# Altium schematic sheet peri.SchDoc: Peripherals
size A3; DrawnBy: MAC; Organization: Altium Limited; DocumentNumber: 4; Revision: 0; SheetNumber: 4; SheetTotal: 4; Project: FotoKite; DrwanWhen: Nov.2013; CheckedWhen: When?; ProjectName: ProjectName?
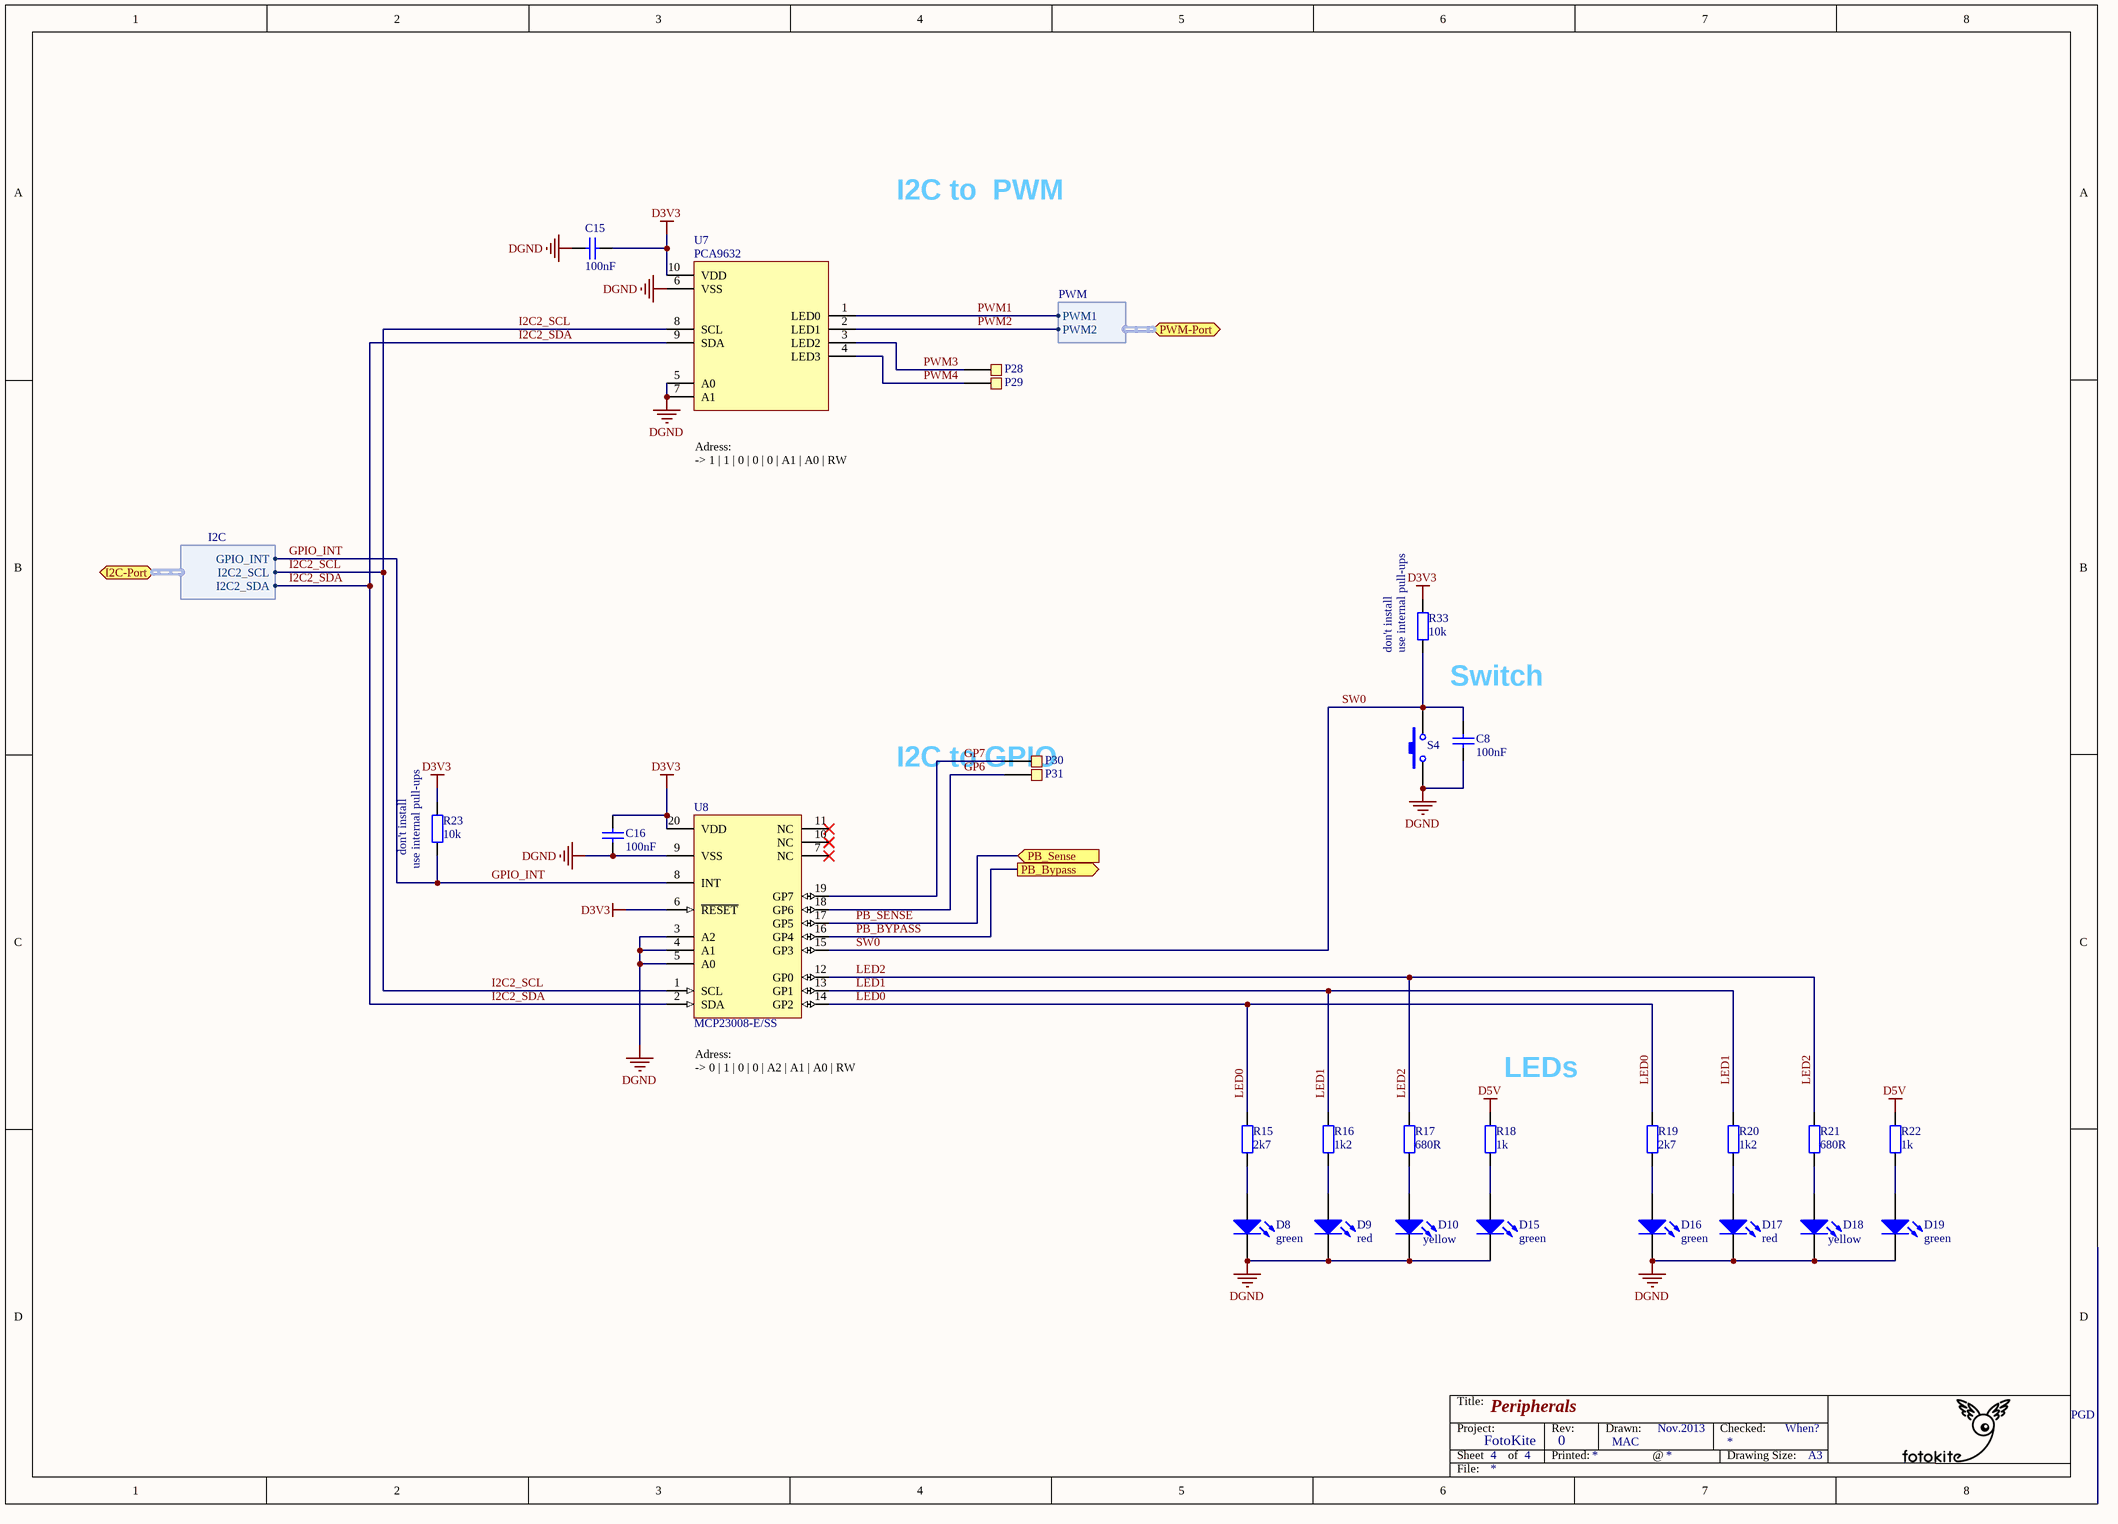
[diagram p0: peri.SchDoc]

## Parts
C8  100nF  [CAP_0603i_1608m -N]
C15  100nF  [CAP_0603i_1608m -N]
C16  100nF  [CAP_0603i_1608m -N]
D8  Colour: green  [LED_LTST_SIDE]  (hidden comment: Diode LED green)
D9  Colour: red  [LED_LTST_SIDE]  (hidden comment: Diode LED red)
D10  Colour: yellow  [LED_LTST_SIDE]  (hidden comment: Diode LED yellow)
D15  Colour: green  [LED_LTST_SIDE]  (hidden comment: Diode LED green)
D16  Colour: green  [LED_LTST_SIDE]  (hidden comment: Diode LED green)
D17  Colour: red  [LED_LTST_SIDE]  (hidden comment: Diode LED red)
D18  Colour: yellow  [LED_LTST_SIDE]  (hidden comment: Diode LED yellow)
D19  Colour: green  [LED_LTST_SIDE]  (hidden comment: Diode LED green)
P28  Pad  [Pad_0603]  (value not drawn)
P29  Pad  [Pad_0603]  (value not drawn)
P30  Pad  [Pad_0603]  (value not drawn)
P31  Pad  [Pad_0603]  (value not drawn)
R15  2k7  [RES_0603i_1608m -N]
R16  1k2  [RES_0603i_1608m -N]
R17  680R  [RES_0603i_1608m -N]
R18  1k  [RES_0603i_1608m -N]
R19  2k7  [RES_0603i_1608m -N]
R20  1k2  [RES_0603i_1608m -N]
R21  680R  [RES_0603i_1608m -N]
R22  1k  [RES_0603i_1608m -N]
R23  10k  Note: don't install  Note2: use internal pull-ups  [RES_0603i_1608m -N]
R33  10k  Note: don't install  Note2: use internal pull-ups  [RES_0603i_1608m -N]
S4  EVQ-PUB02K  [EVQPU]  (value not drawn)
U7  PCA9632  [TSSOP10_L]
U8  MCP23008-E/SS  [SSOP-SS20_N]

## Ports
I2C-Port (harness I2C), PB_Bypass (out), PB_Sense, PWM-Port (harness PWM)

## Harnesses
I2C: GPIO_INT, I2C2_SCL, I2C2_SDA
PWM: PWM1, PWM2

## Nets
D3V3: C15.1 C16.1 R23.2 R33.2 U7.10(VDD) U8.6(~{RESET}) U8.20(VDD)
D5V: R18.2 R22.2
DGND: C8.1 C15.2 C16.2 D8.2(K) D9.2(K) D10.2(K) D15.2(K) D16.2(K) D17.2(K) D18.2(K) D19.2(K) S4.2 U7.5(A0) U7.6(VSS) U7.7(A1) U8.3(A2) U8.4(A1) U8.5(A0) U8.9(VSS)
GP6: P31.1 U8.18(GP6)
GP7: P30.1 U8.19(GP7)
GPIO_INT: R23.1 U8.8(INT) ; port I2C-Port.GPIO_INT
I2C2_SCL: U7.8(SCL) U8.1(SCL) ; port I2C-Port.I2C2_SCL
I2C2_SDA: U7.9(SDA) U8.2(SDA) ; port I2C-Port.I2C2_SDA
LED0: R15.2 R19.2 U8.14(GP2)
LED1: R16.2 R20.2 U8.13(GP1)
LED2: R17.2 R21.2 U8.12(GP0)
PB_BYPASS: U8.16(GP4) ; port PB_Bypass
PB_SENSE: U8.17(GP5) ; port PB_Sense
PWM1: U7.1(LED0) ; port PWM-Port.PWM1
PWM2: U7.2(LED1) ; port PWM-Port.PWM2
PWM3: P28.1 U7.3(LED2)
PWM4: P29.1 U7.4(LED3)
SW0: C8.2 R33.1 S4.1 U8.15(GP3)
NetD8_1: D8.1(A) R15.1
NetD9_1: D9.1(A) R16.1
NetD10_1: D10.1(A) R17.1
NetD15_1: D15.1(A) R18.1
NetD16_1: D16.1(A) R19.1
NetD17_1: D17.1(A) R20.1
NetD18_1: D18.1(A) R21.1
NetD19_1: D19.1(A) R22.1

Not connected (* = marked no-connect by the designer): U8 7(NC)* 10(NC)* 11(NC)*

## Notes on the sheet
- I2C to  PWM
- (near U7) Adress:
  -> 1 | 1 | 0 | 0 | 0 | A1 | A0 | RW
- Switch
- I2C to GPIO
- (near U8) Adress:
  -> 0 | 1 | 0 | 0 | A2 | A1 | A0 | RW
- (near R18) LEDs
- PGD
- Sheet
- Project:
- Title:
- of
- Rev:
- Printed:
- Drawn:
- @
- Checked:
- Drawing Size:
- A3
- File:

## Library data of the parts
C8 C15 C16 = Cap: capacitor
D8 D15 D16 D19 = Diode LED: LED; Note: 1V7 / 2mA; Supplier: Digikey: 160-1478-1-ND
D9 D17 = Diode LED: LED; note: 1V8 / 2mA; Supplier: Digikey: 160-1479-1-ND
D10 D18 = Diode LED: LED; Note: 1V8 / 2mA; Supplier: Digikey: 160-1480-1-ND
P28-P31 = Pad: Single Pad or Testpoint
R15-R23 R33 = Res: Resistor
S4 = SW PB: Switch; Manufacturer ID: Panasonic: EVQ-PUB02K; Supplier: digi-key: P10848SCT-ND
U7 = PCA9632: 0.4A Dual H-Bridge; Manufacturer: Freescale Semiconductor; Supplier: digikey: 	 568-8254-1-ND; Note: *
U8 = CMP-0186-00169-3: 8-Bit I/O Expander with Serial Interface, 20-Pin SSOP, Extended Temperature; PackageVersion: revBB, Aug-2009; Code_JEDEC: MO-150; ComponentLink3URL: http://www.microchip.com/stellent/groups/techpub_sg/documents/packagingspec/en012702.pdf; PackageReference: SSOP-SS20; ComponentLink2Description: Datasheet; ComponentLink1URL: http://www.microchip.com/; ComponentLink2URL: http://ww1.microchip.com/downloads/en/DeviceDoc/21919e.pdf; RevisionNote: Sch corrected.; PackageDescription: 20-Lead Plastic Shrink Small Outline (SS) - 5.3mm Body [SSOP]; ComponentLink1Description: Manufacturer URL; ComponentLink3Description: Package Specification; DatasheetVersion: revE, Aug-2007